# EAGLE design wagband_schematic_v1_FINAL (EAGLE 7.5.0)
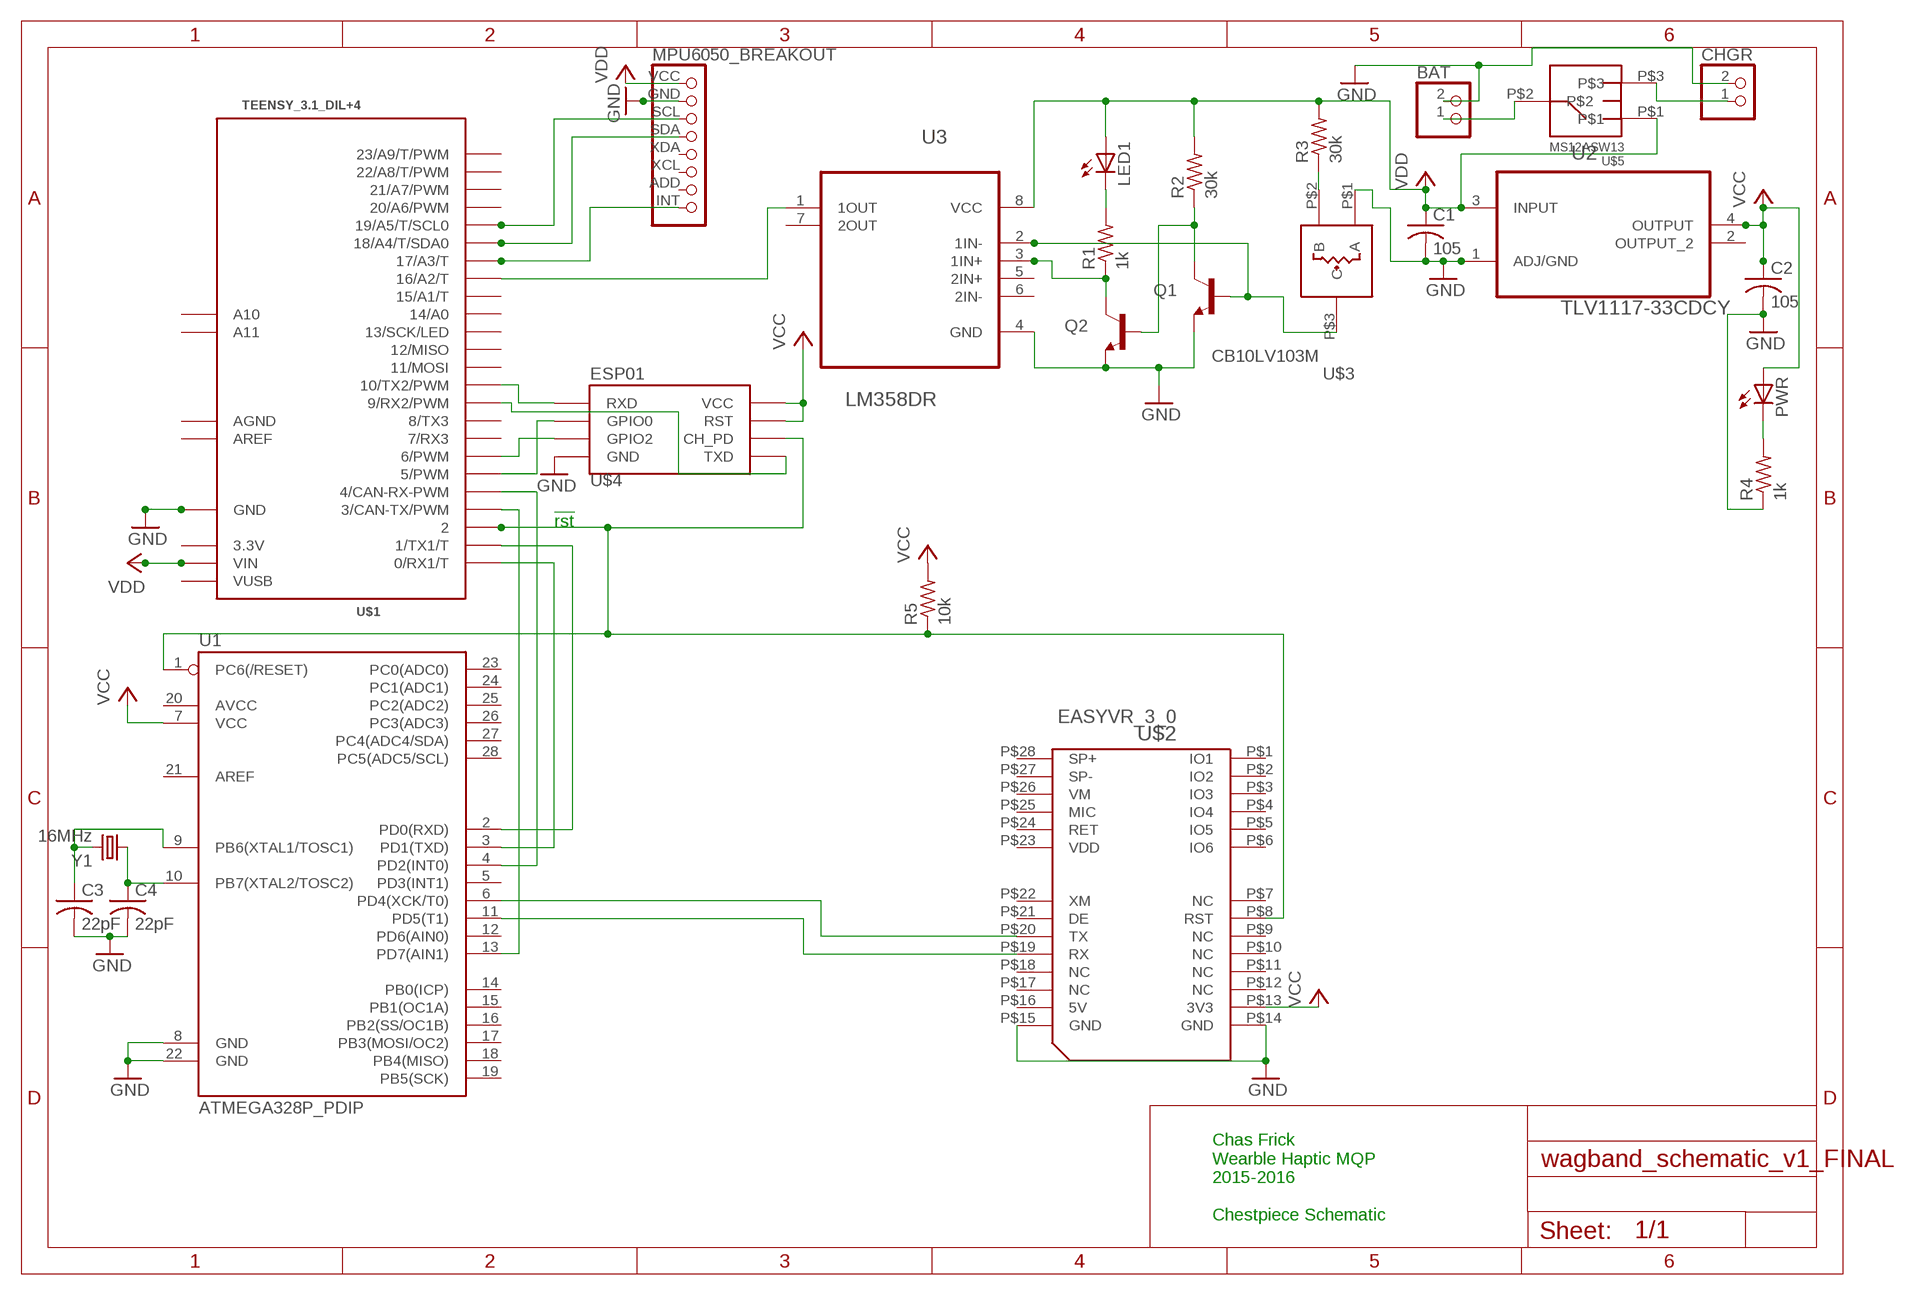
[diagram p0: schematic, sheet 1]

## Parts
BAT  JST_2PIN-THM-RA  [JST-PH-2-THM-RA]
C1  105  C-USC0805K  [C0805K]
C2  105  C-USC0805K  [C0805K]
C3  22pF  C-USC1206K  [C1206K]
C4  22pF  C-USC1206K  [C1206K]
CHGR  JST_2PIN-THM-RA  [JST-PH-2-THM-RA]
LED1  LED5MM  [LED5MM]
MPU6050_BREAKOUT  MPU6050_BREAKOUT  [MPU6050]
PWR  LED5MM  [LED5MM]
Q1  TRANSISTOR_NPNMMBT3904  [SOT-23]
Q2  TRANSISTOR_NPNMMBT3904  [SOT-23]
R1  1k  R-US_R1206  [R1206]
R2  30k  R-US_R1206  [R1206]
R3  30k  R-US_R1206  [R1206]
R4  1k  R-US_R1206  [R1206]
R5  10k  R-US_R1206  [R1206]
U1  ATMEGA328P_PDIP  [DIL28-3]
U2  TLV1117-33CDCY  [SOT230P700X180-4N]
U3  LM358DR  [SOIC127P600X175-8N]
U$1  TEENSY_3.1_DIL+4  [TEENSY3-DIL+4]
U$2  EASYVR_3_0  [EASYVR_3_0]
U$3  CB10LV103M  [CB10]
U$4  ESP01  [ESP01]
U$5  MS12ASW13  [SPDT]
Y1  16MHz  CRYSTALSMD  [HC49UP]

## Nets
!RST: R5.1 U1.1(PC6(/RESET)) U$1.2 U$2.P$8(RST) U$4.CH_PD
GND: BAT.2 C1.2 C2.2 C3.2 C4.2 CHGR.2 MPU6050_BREAKOUT.GND Q1.2(E) Q2.2(E) R4.1 U1.8(GND) U1.22(GND) U2.1(ADJ/GND) U3.4(GND) U$1.GND U$2.P$14(GND) U$2.P$15(GND) U$3.P$1(A) U$4.GND
N$1: U1.4(PD2(INT0)) U$1.4(4/CAN-RX-PWM)
N$2: U$1.10(10/TX2/PWM) U$4.RX(RXD)
N$3: MPU6050_BREAKOUT.SDA U$1.18/A4(18/A4/T/SDA0)
N$4: Q1.1(B) U3.2(1IN-) U$3.P$3(C)
N$5: U1.11(PD5(T1)) U$2.P$19(RX)
N$6: U1.6(PD4(XCK/T0)) U$2.P$20(TX)
N$7: U$1.5(5/PWM) U$4.GPIO0
N$8: MPU6050_BREAKOUT.INT U$1.17/A3(17/A3/T)
N$9: Q1.3(C) Q2.1(B) R2.1
N$10: Q2.3(C) R1.1 U3.3(1IN+)
N$11: R3.1 U$3.P$2(B)
N$12: LED1.K(C) R1.2
N$13: U1.2(PD0(RXD)) U$1.1(1/TX1/T)
N$14: U3.1(1OUT) U$1.16/A2(16/A2/T)
N$15: PWR.K(C) R4.2
N$16: U1.13(PD7(AIN1)) U$1.3(3/CAN-TX/PWM)
N$17: MPU6050_BREAKOUT.SCL U$1.19/A5(19/A5/T/SCL0)
N$18: U$1.6(6/PWM) U$4.GPIO2
N$19: U$1.9(9/RX2/PWM) U$4.TX(TXD)
N$20: C3.1 U1.9(PB6(XTAL1/TOSC1)) Y1.2
N$21: C4.1 U1.10(PB7(XTAL2/TOSC2)) Y1.1
N$22: U1.3(PD1(TXD)) U$1.0(0/RX1/T)
N$23: BAT.1 U$5.P$2
N$25: CHGR.1 U$5.P$3
VCC: C1.1 C2.1 LED1.A MPU6050_BREAKOUT.VCC PWR.A R2.2 R3.2 R5.2 U1.7(VCC) U2.3(INPUT) U2.4(OUTPUT) U3.8(VCC) U$1.VIN U$2.P$13(3V3) U$4.RST U$4.VCC U$5.P$1 ; supply symbol labelled VDD
Unconnected: MPU6050_BREAKOUT.ADD MPU6050_BREAKOUT.XCL MPU6050_BREAKOUT.XDA U1.5(PD3(INT1)) U1.12(PD6(AIN0)) U1.14(PB0(ICP)) U1.15(PB1(OC1A)) U1.16(PB2(SS/OC1B)) U1.17(PB3(MOSI/OC2)) U1.18(PB4(MISO)) U1.19(PB5(SCK)) U1.20(AVCC) U1.21(AREF) U1.23(PC0(ADC0)) U1.24(PC1(ADC1)) U1.25(PC2(ADC2)) U1.26(PC3(ADC3)) U1.27(PC4(ADC4/SDA)) U1.28(PC5(ADC5/SCL)) U2.2(OUTPUT_2) U3.5(2IN+) U3.6(2IN-) U3.7(2OUT) U$1.7(7/RX3) U$1.8(8/TX3) U$1.11(11/MOSI) U$1.12(12/MISO) U$1.13(13/SCK/LED) U$1.14/A0 U$1.15/A1(15/A1/T) U$1.20/A6(20/A6/PWM) U$1.21/A7(21/A7/PWM) U$1.22/A8(22/A8/T/PWM) U$1.23/A9(23/A9/T/PWM) U$1.A10 U$1.A11 U$2.P$1(IO1) U$2.P$2(IO2) U$2.P$3(IO3) U$2.P$4(IO4) U$2.P$5(IO5) U$2.P$6(IO6) U$2.P$7(NC) U$2.P$9(NC) U$2.P$10(NC) U$2.P$11(NC) U$2.P$12(NC) U$2.P$17(NC) U$2.P$18(NC) U$2.P$21(DE) U$2.P$22(XM) U$2.P$24(RET) U$2.P$25(MIC) U$2.P$26(VM) U$2.P$27(SP-) U$2.P$28(SP+)

## Notes on the sheet
- !rst
- Chas Frick
  Wearble Haptic MQP
  2015-2016
  
  Chestpiece Schematic

## Power pins joined to a net without a drawn wire
3.3V: U$1.3.3V
5V: U$2.P$16(5V)
AGND: U$1.AGND
AREF: U$1.AREF
VDD: U$2.P$23(VDD)
VUSB: U$1.VUSB

## Library data of the parts
BAT CHGR = adafruit:JST_2PIN: JST 2-Pin Connectors of various flavors SMT-RA (S2B-PH-SM4) 4UConnector #17311 SMT (B2B-PH-SM4) THM-RA (S2B-PH) THM (B2B-PH)
C1 C2 = resistor:C-US: CAPACITOR, American symbol
C3 C4 = rcl:C-US: CAPACITOR, American symbol
LED1 PWR = led:LED: LED OSRAM: - CHIPLED LG R971, LG N971, LY N971, LG Q971, LY Q971, LO R971, LY R971 LH N974, LH R974 LS Q976, LO Q976, LY Q976 LO Q996 - Hyper CHIPLED LW Q18S LB Q993, LB Q99A, LB R99A - SideLED LS A670, LO A670, LY A670, LG A670, LP A670 LB A673, LV A673, LT A673, LW A673 LH A674 LY A675 LS A676, LA A676, LO A676, LY A676, LW A676 LS A679, LY A679, LG A679 - Hyper Micro SIDELED® LS Y876, LA Y876, LO Y876, LY Y876 LT Y87S - SmartLED LW L88C, LW L88S LB L89C, LB L89S, LG L890 LS L89K, LO L89K, LY L89K LS L896, LA L896, LO L896, LY L896 - TOPLED LS T670, LO T670, LY T670, LG T670, LP T670 LSG T670, LSP T670, LSY T670, LOP T670, LYG T670 LG T671, LOG T671, LSG T671 LB T673, LV T673, LT T673, LW T673 LH T674 LS T676, LA T676, LO T676, LY T676, LB T676, LH T676, LSB T676, LW T676 LB T67C, LV T67C, LT T67C, LS T67K, LO T67K, LY T67K, LW E67C LS E67B, LA E67B, LO E67B, LY E67B, LB E67C, LV E67C, LT E67C LW T67C LS T679, LY T679, LG T679 LS T770, LO T770, LY T770, LG T770, LP T770 LB T773, LV T773, LT T773, LW T773 LH T774 LS E675, LA E675, LY E675, LS T675 LS T776, LA T776, LO T776, LY T776, LB T776 LHGB T686 LT T68C, LB T68C - Hyper Mini TOPLED® LB M676 - Mini TOPLED Santana® LG M470 LS M47K, LO M47K, LY M47K Source: http://www.osram.convergy.de LUXEON: - LUMILED® LXK2-PW12-R00, LXK2-PW12-S00, LXK2-PW14-U00, LXK2-PW14-V00 LXK2-PM12-R00, LXK2-PM12-S00, LXK2-PM14-U00 LXK2-PE12-Q00, LXK2-PE12-R00, LXK2-PE12-S00, LXK2-PE14-T00, LXK2-PE14-U00 LXK2-PB12-K00, LXK2-PB12-L00, LXK2-PB12-M00, LXK2-PB14-N00, LXK2-PB14-P00, LXK2-PB14-Q00 LXK2-PR12-L00, LXK2-PR12-M00, LXK2-PR14-Q00, LXK2-PR14-R00 LXK2-PD12-Q00, LXK2-PD12-R00, LXK2-PD12-S00 LXK2-PH12-R00, LXK2-PH12-S00 LXK2-PL12-P00, LXK2-PL12-Q00, LXK2-PL12-R00 Source: www.luxeon.com KINGBRIGHT: KA-3528ASYC Source: www.kingbright.com
MPU6050_BREAKOUT = mqp_custom_parts:MPU6050_BREAKOUT: PIN HEADER
Q1 Q2 = mqp_custom_parts:TRANSISTOR_NPN: MMBT3904LT1G Made for the MMBT3904LT1G from ON Semiconductor See here: http://www.newark.com/on-semiconductor/mmbt3904lt1g/bipolar-transistor-npn-40v-sot/dp/83H7337 NPN BJT with 200mA capacity and 40V Vce breakdown
R1-R5 = resistor:R-US_: RESISTOR, American symbol
U1 = SparkFun-DigitalIC:ATMEGA328P_PDIP: uC used in the Arduino 32kb flash, 1k EEPROM, 2k SRAM This is the through-hole version of this chip.
U2 = Texas Instruments_By_element14_Batch_1:TLV1117-33CDCY: V REG, LDO, 3.3V, 0.8A; MPN: TLV1117-33CDCY; OC_FARNELL: 1494942; OC_NEWARK: 67K8520; PACKAGE: SOT-223-3; SUPPLIER: TEXAS INSTRUMENTS
U3 = Texas Instruments_By_element14_Batch_1:LM358DR: OPERATIONAL AMPLIFIERS; MPN: LM358DR; OC_FARNELL: 1831865; OC_NEWARK: 34K7599; PACKAGE: SOIC-8; SUPPLIER: Texas Instruments
U$1 = Teensy_3_and_LC_Series_Boards_v1.1:TEENSY_3.1_DIL+4: Teensy 3.1 and 3.2 in a DIL package with the inner 4 pins
U$2 = mqp_custom_parts:EASYVR_3_0
U$3 = mqp_custom_parts:CB10LV103M
U$4 = esp8266modules:ESP01: ESP8266 Wifi module 01
U$5 = mqp_custom_parts:MS12ASW13
Y1 = SparkFun-FreqCtrl:CRYSTAL: Various standard crystals. Proven footprints.

## Board
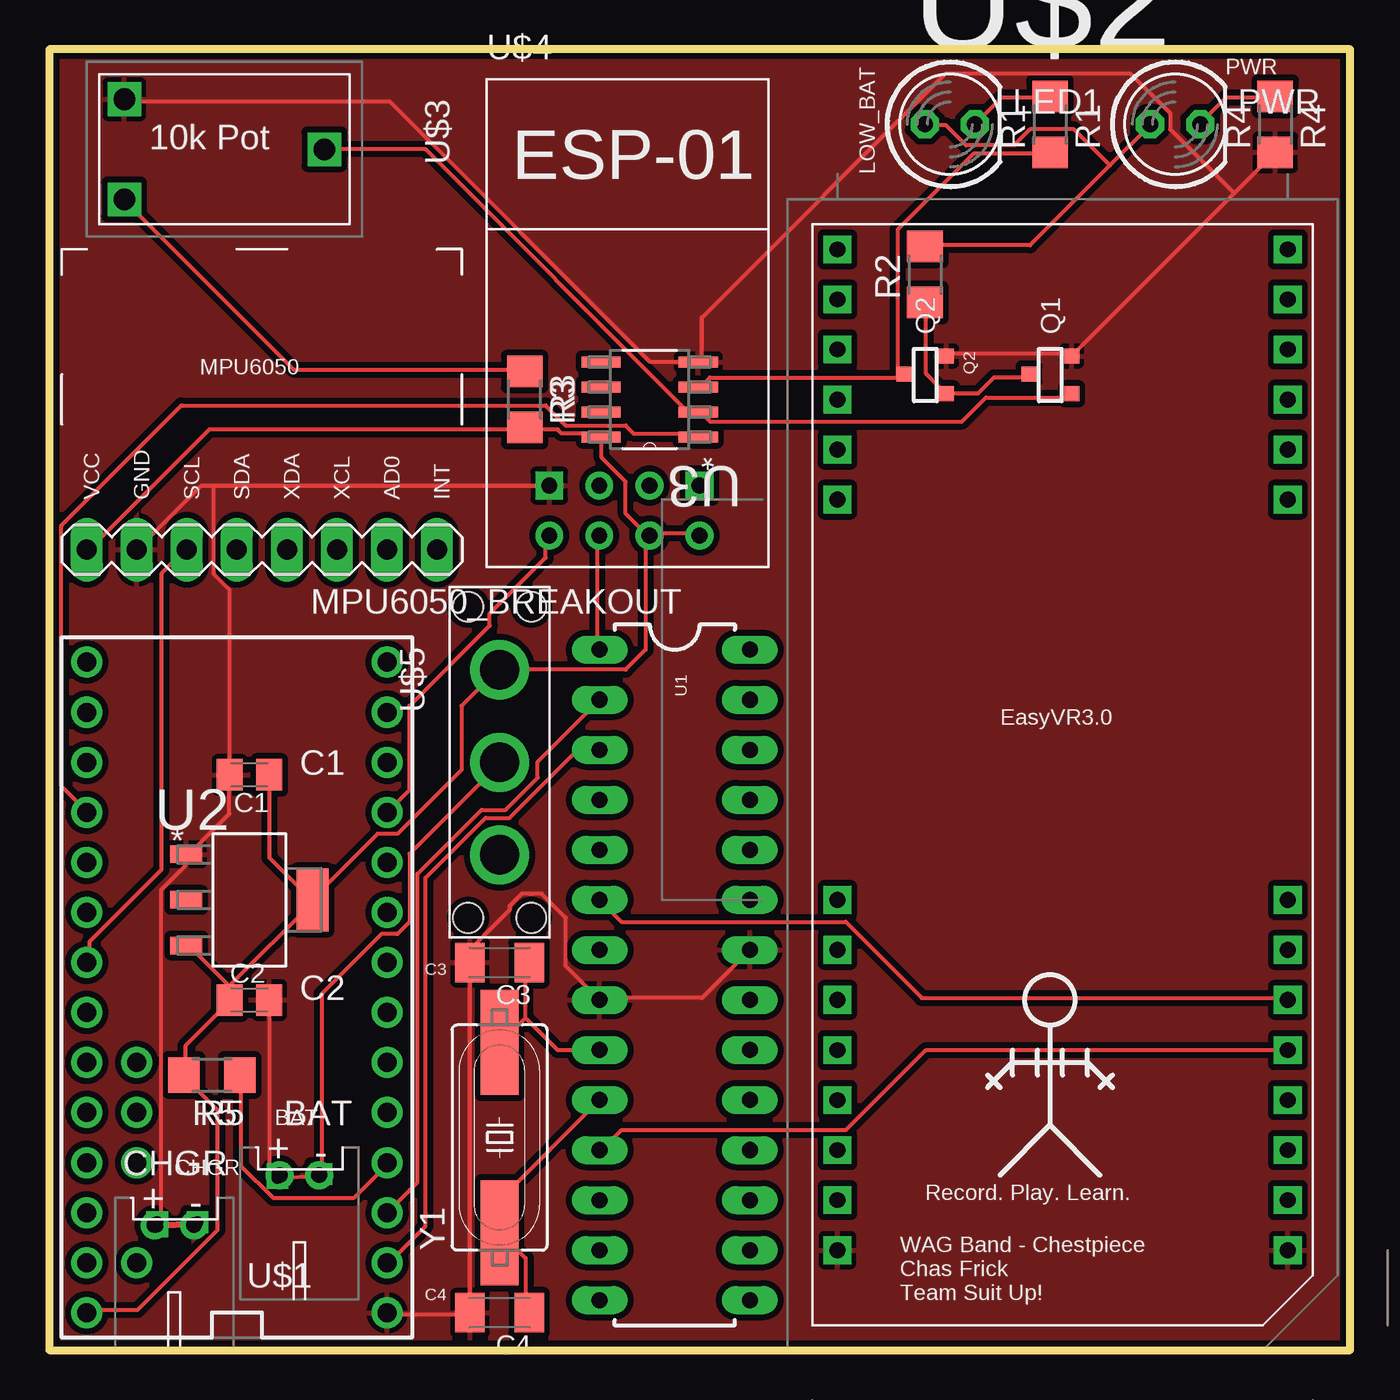
[diagram p1: board, top side]
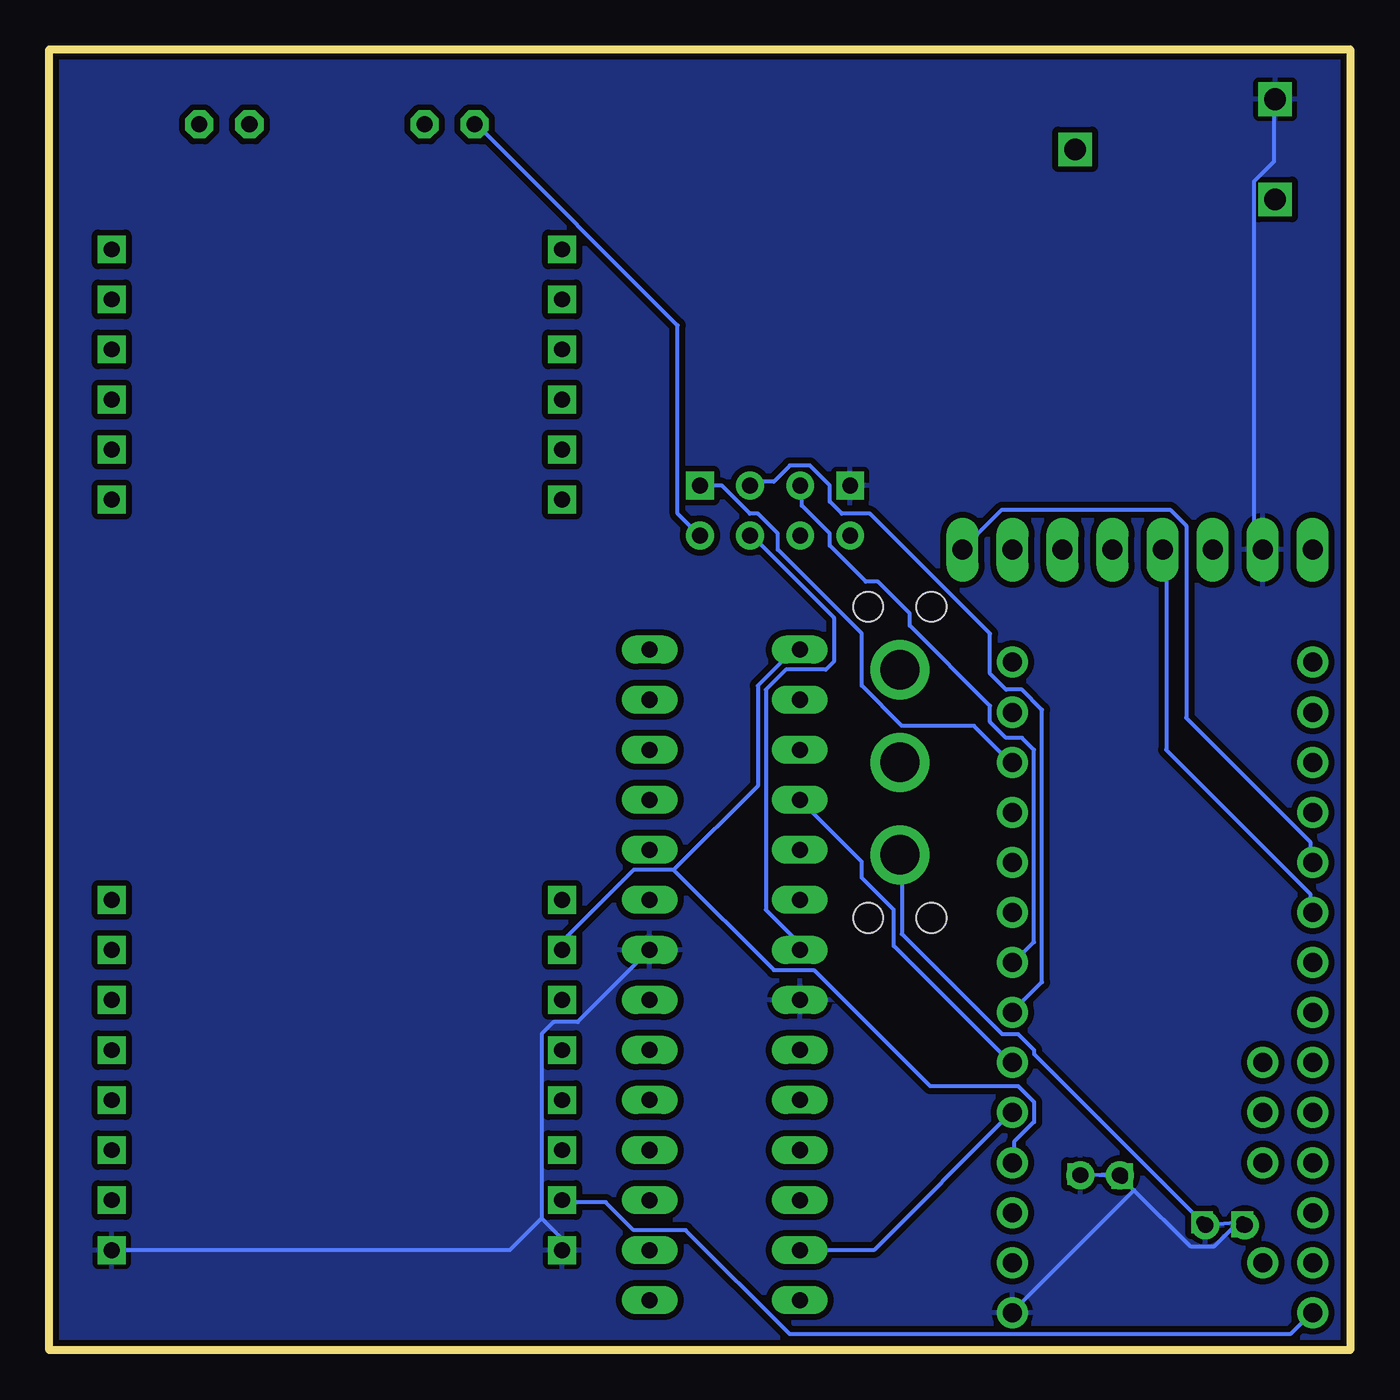
[diagram p2: board, bottom side, seen from below]

Size 66.04 x 66.04 mm. Coordinates in mm from the lower left corner, seen from the top.
Outline: 0,0 66.04,0 66.04,66.04 0,66.04 0,0
Copper layers (1*16): Top 0.035mm / dielectric 1.5mm / Bottom 0.035mm
Design rules "SparkFun": minimum track width 8mil, minimum drill 20mil, track to track 8mil, track to pad 8mil, pad to pad 8mil, via to via 8mil, smd to smd 8mil, copper to edge 8mil, drill to drill 8mil, minimum pad ring 12mil, minimum via ring 10mil, stop-mask expansion 4mil, vias tented up to drill 20mil, thermal gap 10mil

### Footprints (pad centres in the part's own frame; a part is rotated, then mirrored left to right if it is on the bottom)
JST-PH-2-THM-RA = drill 0.8 pad 1.422: 1 1,0; 2 -1,0
C0805K = smd 1.3 x 1.6: 1 -1,0; 2 1,0
C1206K = smd 1.5 x 2: 1 -1.5,0; 2 1.5,0
LED5MM = drill 0.813 octagon: A -1.27,0; K 1.27,0
MPU6050 = drill 1.016 long: ADD 6.35,0; GND -6.35,0; INT 8.89,0; SCL -3.81,0; SDA -1.27,0; VCC -8.89,0; XCL 3.81,0; XDA 1.27,0
SOT-23 = smd 0.762 x 0.762: 1 -0.979,-1.101; 2 0.94,-1.101; 3 0.025,1.067
R1206 = smd 1.6 x 1.803: 1 -1.422,0; 2 1.422,0
DIL28-3 = drill 0.813 long: 1 -16.51,-3.81; 2 -13.97,-3.81; 3 -11.43,-3.81; 4 -8.89,-3.81; 5 -6.35,-3.81; 6 -3.81,-3.81; 7 -1.27,-3.81; 8 1.27,-3.81; 9 3.81,-3.81; 10 6.35,-3.81; 11 8.89,-3.81; 12 11.43,-3.81; 13 13.97,-3.81; 14 16.51,-3.81; 15 16.51,3.81; 16 13.97,3.81; 17 11.43,3.81; 18 8.89,3.81; 19 6.35,3.81; 20 3.81,3.81; 21 1.27,3.81; 22 -1.27,3.81; 23 -3.81,3.81; 24 -6.35,3.81; 25 -8.89,3.81; 26 -11.43,3.81; 27 -13.97,3.81; 28 -16.51,3.81
SOT230P700X180-4N = smd 1.626 x 0.889: 1 -3.2,2.311; 2 -3.2,0; 3 -3.2,-2.311 | smd 1.626 x 3.175: 4 3.2,0
SOIC127P600X175-8N = smd 1.981 x 0.559: 1 -2.464,1.905; 2 -2.464,0.635; 3 -2.464,-0.635; 4 -2.464,-1.905; 5 2.464,-1.905; 6 2.464,-0.635; 7 2.464,0.635; 8 2.464,1.905
TEENSY3-DIL+4 = drill 0.965: 0 -7.62,13.97; 1 -7.62,11.43; 2 -7.62,8.89; 3 -7.62,6.35; 3.3V 7.62,11.43; 4 -7.62,3.81; 5 -7.62,1.27; 6 -7.62,-1.27; 7 -7.62,-3.81; 8 -7.62,-6.35; 9 -7.62,-8.89; 10 -7.62,-11.43; 11 -7.62,-13.97; 12 -7.62,-16.51; 13 7.62,-16.51; 14/A0 7.62,-13.97; 15/A1 7.62,-11.43; 16/A2 7.62,-8.89; 17/A3 7.62,-6.35; 18/A4 7.62,-3.81; 19/A5 7.62,-1.27; 20/A6 7.62,1.27; 21/A7 7.62,3.81; 22/A8 7.62,6.35; 23/A9 7.62,8.89; A10 5.08,6.35; A11 5.08,3.81; AGND 7.62,13.97; AREF 5.08,8.89; GND -7.62,16.51; VIN 7.62,16.51; VUSB 5.08,13.97
EASYVR_3_0 = drill 0.8 square: P$1 -11.43,25.4; P$2 -11.43,22.86; P$3 -11.43,20.32; P$4 -11.43,17.78; P$5 -11.43,15.24; P$6 -11.43,12.7; P$7 -11.43,-7.62; P$8 -11.43,-10.16; P$9 -11.43,-12.7; P$10 -11.43,-15.24; P$11 -11.43,-17.78; P$12 -11.43,-20.32; P$13 -11.43,-22.86; P$14 -11.43,-25.4; P$15 11.43,-25.4; P$16 11.43,-22.86; P$17 11.43,-20.32; P$18 11.43,-17.78; P$19 11.43,-15.24; P$20 11.43,-12.7; P$21 11.43,-10.16; P$22 11.43,-7.62; P$23 11.43,12.7; P$24 11.43,15.24; P$25 11.43,17.78; P$26 11.43,20.32; P$27 11.43,22.86; P$28 11.43,25.4
CB10 = drill 1.1 square: P$1 -2.54,-5.08; P$2 2.54,-5.08; P$3 0,5.08
ESP01 = drill 0.8: CH_PD -1.285,-8.178; GPIO0 1.255,-5.638; GPIO2 -1.285,-5.638; RST 1.255,-8.178; TX -3.825,-8.178; VCC 3.795,-8.178 | drill 0.8 square: GND -3.825,-5.638; RX 3.795,-5.638
SPDT = drill 2: P$1 0,-4.699; P$2 0,0; P$3 0,4.699 | hole 1.5: 1.6,7.899; -1.6,-7.899; 1.6,-7.899; -1.6,7.899
HC49UP = smd 5.334 x 1.93: 1 -4.826,0; 2 4.826,0

### Placement (x,y rotation side)
BAT  12.7,8.89 180 top
C1  10.16,29.21 180 top
C2  10.16,17.78 0 top
C3  22.86,19.68 180 top
C4  22.86,1.91 180 top
CHGR  6.35,6.35 180 top
LED1  45.72,62.23 0 top
MPU6050_BREAKOUT  10.79,40.64 0 top
PWR  57.15,62.23 0 top
Q1  50.8,49.53 90 top
Q2  44.45,49.53 90 top
R1  50.8,62.23 90 top
R2  44.45,54.61 90 top
R3  24.13,48.26 270 top
R4  62.23,62.23 90 top
R5  8.26,13.97 180 top
U1  31.75,19.05 270 top
U2  10.16,22.86 0 top
U3  30.48,48.26 180 top
U$1  9.53,18.41 180 top
U$2  51.44,30.48 0 top
U$3  8.89,60.96 270 top
U$4  29.21,49.53 0 top
U$5  22.86,29.84 180 top
Y1  22.86,10.79 90 top

### Tracks (layer width: path | path; a pad name or v marks a point on that pad's centre or on a via)
!RST
  Top 0.203: R5.1 9.75,13.82 9.75,9.35 11.38,7.72 15.44,7.72 17.07,9.35 U$1.2 | U$4.CH_PD 27.84,41.25 27.84,35.56 U1.1
  Bottom 0.203: 34.34,24.38 36.37,24.38 39.83,20.93 39.83,20.32 U$2.P$8 | 34.34,24.38 30.07,28.65 30.07,33.73 28.25,35.56 U1.1 | 34.34,24.38 29.26,19.3 27.23,19.3 21.34,13.41 16.87,13.41 16.05,12.6 16.05,11.58 17.07,10.57 17.07,9.55 U$1.2
GND  (via drill 0.6)
  Top 0.203: Q2.2 45.72,50.6 51.82,50.6 Q1.2 52.02,50.6 60.15,58.73 | 60.15,58.73 62.18,60.76 R4.1 | 3.86,63.4 17.27,63.4 30.48,50.19 32.92,50.19 U3.4 33.12,50.19 33.12,52.43 45.52,64.82 54.86,64.82 56.9,62.79 56.9,61.98 60.15,58.73 | 8.33,43.89 7.72,43.89 4.47,40.64 MPU6050_BREAKOUT.GND | 8.33,43.89 25.2,43.89 U$4.GND | 8.33,43.89 8.33,39.42 9.14,38.61 9.14,29.26 C1.2 9.14,29.06 9.14,27.23 7.11,25.2 U2.1 6.91,24.99 6.91,24.59 5.69,23.37 5.69,6.71 v5.49,6.5 | U$1.GND 17.27,1.83 21.34,1.83 C4.2 21.34,2.03 21.34,19.51 C3.2 21.54,19.71 21.54,20.52 23.37,22.35 23.37,22.55 23.98,23.16 24.99,23.16 26.21,21.95 26.21,19.51 U1.8 28.04,17.88 33.12,17.88 U1.22 | v11.58,8.94 11.18,9.35 11.18,17.68 C2.2 | v5.49,6.3 CHGR.2 | v11.58,8.74 BAT.2
  Bottom 0.203: v11.58,8.94 BAT.2 | v5.49,6.3 5.89,6.3 6.91,5.28 8.13,5.28 10.97,8.13 | v11.58,8.74 10.97,8.13 | 10.97,8.13 17.07,2.03 U$1.GND | 41.05,6.71 40.03,5.69 40.03,5.08 U$2.P$14 | 41.05,6.71 41.05,16.05 40.44,16.66 39.22,16.66 U1.22 | U$2.P$15 42.67,5.08 41.05,6.71 | v5.49,6.5 CHGR.2 | 3.86,63.4 3.86,60.35 4.88,59.33 4.88,41.05 4.47,40.64 MPU6050_BREAKOUT.GND
  pour Top (isolate 0.305): 0,66.04 0,0 66.04,0 66.04,66.04
  pour Bottom (isolate 0.305): 0,66.04 0,0 66.04,0 66.04,66.04
N$1
  Bottom 0.203: U1.4 24.79,24.79 24.79,23.98 23.16,22.35 23.16,20.52 17.27,14.63 U$1.4
N$2
  Bottom 0.203: U$4.RX 32.92,43.89 31.9,43.89 30.48,42.47 30.07,42.47 29.06,41.45 29.06,40.64 24.79,36.37 24.79,33.73 22.76,31.7 19.1,31.7 17.27,29.87 U$1.10
N$3
  Bottom 0.203: U$1.18/A4 2.03,22.35 2.03,23.16 9.35,30.48 9.35,40.64 MPU6050_BREAKOUT.SDA
N$4
  Top 0.203: Q1.1 51.82,48.36 47.55,48.36 46.33,47.14 33.53,47.14 33.12,47.55 U3.2 32.92,47.75 32.31,47.75 19.1,60.96 U$3.P$3
N$5
  Top 0.203: U$2.P$19 44.5,15.24 40.44,11.18 29.06,11.18 28.04,10.16 U1.11
N$6
  Top 0.203: U1.6 29.06,21.74 40.44,21.74 44.3,17.88 62.79,17.88 U$2.P$20
N$7
  Bottom 0.203: U$4.GPIO0 30.28,44.09 29.26,44.09 28.45,44.91 27.43,44.91 26.42,43.89 26.42,43.08 25.81,42.47 24.38,42.47 18.29,36.37 18.29,34.34 17.48,33.53 16.66,33.53 15.65,32.51 15.65,18.69 17.07,17.27 U$1.5
N$8
  Bottom 0.203: U$1.17/A3 2.03,24.79 2.03,25.81 8.33,32.11 8.33,41.86 9.14,42.67 17.68,42.67 19.71,40.64 MPU6050_BREAKOUT.INT
N$9
  Top 0.203: Q1.3 49.58,49.38 47.95,49.38 47.14,48.56 45.72,48.56 Q2.1 45.52,48.56 44.5,49.58 44.5,53.03 R2.1
N$10
  Top 0.203: 43.08,49.38 33.53,49.38 33.12,48.97 U3.3 | 43.08,49.38 43.28,49.38 Q2.3 43.08,49.38 | 43.08,49.38 43.08,56.9 46.94,60.76 50.8,60.76 R1.1
N$11
  Top 0.203: 3.86,58.32 4.42,57.76 | 4.42,57.76 12.39,49.78 23.98,49.78 R3.1 | U$3.P$2 4.45,57.78 4.42,57.76
N$12
  Top 0.203: LED1.K 48.36,63.6 50.8,63.6 R1.2
N$13
  Top 0.203: U1.2 24.79,29.87 24.79,29.06 23.16,27.43 21.95,27.43 18.69,24.18 18.69,8.53 U$1.1
N$14
  Top 0.203: U3.1 32.92,46.53 29.67,46.53 29.26,46.94 26.21,46.94 25.2,47.95 6.71,47.95 0.61,41.86 0.61,28.65 1.83,27.43 U$1.16/A2
N$15
  Top 0.203: R4.2 62.18,63.6 59.74,63.6 58.52,62.38 PWR.K
N$16
  Bottom 0.203: U1.13 24.18,5.08 17.27,11.99 U$1.3
N$17
  Top 0.203: U$1.19/A5 2.03,19.71 2.03,20.73 5.69,24.38 5.69,39.42 6.91,40.64 MPU6050_BREAKOUT.SCL
N$18
  Bottom 0.203: U$4.GPIO2 27.84,43.89 27.84,42.88 26.42,41.45 26.42,40.84 24.59,39.01 23.98,39.01 22.35,37.39 22.35,36.78 18.29,32.72 18.29,31.9 17.48,31.09 16.66,31.09 16.05,30.48 16.05,20.73 17.07,19.71 U$1.6
N$19
  Top 0.203: U$1.9 18.29,28.45 18.29,32.72 22.35,36.78 22.35,37.39 25.2,40.23 25.2,41.25 U$4.TX
N$20
  Top 0.203: 24.18,16.87 24.18,19.51 C3.1 | 24.18,16.87 22.96,15.65 Y1.2 | U1.9 25.81,15.24 24.18,16.87
N$21
  Top 0.203: C4.1 24.18,2.03 24.18,4.67 22.96,5.89 Y1.1 22.96,6.1 22.96,7.72 U1.10
N$22
  Top 0.203: U1.3 26.82,30.48 23.37,27.03 22.15,27.03 19.1,23.98 19.1,6.3 17.27,4.47 U$1.0
N$23  (via drill 0.6)
  Top 0.203: v13.82,8.94 13.82,18.09 16.87,21.13 17.68,21.13 18.29,21.74 18.29,25.2 22.76,29.67 U$5.P$2
  Bottom 0.203: v13.82,8.94 BAT.1
N$25  (via drill 0.6)
  Top 0.203: v7.52,6.5 CHGR.1
  Bottom 0.203: v7.52,6.5 16.05,15.04 16.05,15.24 16.87,16.05 17.68,16.05 22.76,21.13 22.76,24.99 U$5.P$3
VCC
  Top 0.203: MPU6050_BREAKOUT.VCC 2.03,40.64 8.13,46.74 23.98,46.74 R3.2 24.18,46.74 25.81,46.74 26.01,46.53 27.84,46.53 U3.8 28.04,46.33 28.04,45.31 29.26,44.09 29.26,42.47 30.28,41.45 U$4.RST | 9.14,18.49 9.14,17.88 C2.1 | 9.14,18.49 7.11,20.52 U2.3 | C2.1 9.14,17.68 6.91,15.44 6.91,14.02 R5.2 6.91,13.82 8.53,12.19 8.53,6.1 4.47,2.03 2.03,2.03 U$1.VIN | C1.1 11.18,29.06 11.18,24.99 13.21,22.96 U2.4 | 9.14,18.49 13.41,22.76 U2.4 | 9.14,18.49 C2.1 | 53.85,60.15 55.88,62.18 PWR.A | 53.85,60.15 49.78,56.08 44.5,56.08 R2.2 | 53.85,60.15 52.02,61.98 49.78,61.98 48.97,61.16 46.53,61.16 45.52,62.18 44.5,62.18 LED1.A | U$4.RST 30.48,41.45 32.92,41.45 U$4.VCC | U$4.RST 30.28,41.25 30.28,35.56 29.26,34.54 U$5.P$1 22.76,34.54 20.93,32.72 20.93,29.46 17.68,26.21 16.66,26.21 13.41,22.96 U2.4
  Bottom 0.203: U$2.P$13 39.83,7.52 37.8,7.52 36.37,6.1 33.73,6.1 28.45,0.81 3.05,0.81 2.03,1.83 U$1.VIN | U1.7 28.04,20.32 28.04,20.73 29.67,22.35 29.67,33.53 28.65,34.54 26.62,34.54 26.21,34.95 26.21,37.19 30.28,41.25 U$4.RST | LED1.A 44.3,62.18 34.14,52.02 34.14,42.47 33.12,41.45 U$4.VCC

### Text on the board
tPlace: PWR | R1 | R4 | LOW_BAT | R2 | MPU6050 | Q2 | R3 | VCC | GND | SCL | SDA | XDA | XCL | AD0 | INT | EasyVR3.0 | C1 | C3 | C2 | R5 | BAT | CHGR | Record. Play. Learn. | C4 | WAG Band - Chestpiece / Chas Frick / Team Suit Up!